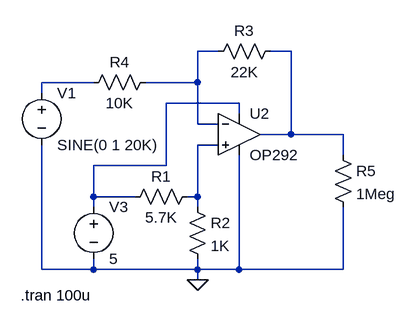
[diagram p0: schematic OpAmp-Simulation.asc]
OpAmp-Simulation.asc, the LTspice schematic file:
Version 4
SHEET 1 880 680
WIRE 64 32 32 32
WIRE 176 32 144 32
WIRE -128 80 -208 80
WIRE 32 80 32 32
WIRE 32 80 -48 80
WIRE -208 96 -208 80
WIRE 96 112 -16 112
WIRE 96 128 96 112
WIRE 32 144 32 80
WIRE 64 144 32 144
WIRE 176 160 176 32
WIRE 176 160 128 160
WIRE 256 160 176 160
WIRE 64 176 32 176
WIRE 256 192 256 160
WIRE -16 208 -16 112
WIRE -16 208 -128 208
WIRE -128 256 -128 208
WIRE -64 256 -128 256
WIRE 32 256 32 176
WIRE 32 256 16 256
WIRE -128 272 -128 256
WIRE 32 272 32 256
WIRE -208 368 -208 176
WIRE -128 368 -128 352
WIRE -128 368 -208 368
WIRE 32 368 32 352
WIRE 32 368 -128 368
WIRE 96 368 96 192
WIRE 96 368 32 368
WIRE 256 368 256 272
WIRE 256 368 96 368
WIRE 32 384 32 368
FLAG 32 384 0
SYMBOL voltage -208 80 R0
WINDOW 123 0 0 Left 0
WINDOW 39 0 0 Left 0
SYMATTR InstName V1
SYMATTR Value SINE(0 1 20K)
SYMBOL Opamps\\OP292 96 96 R0
SYMATTR InstName U2
SYMBOL res 32 240 R90
WINDOW 0 0 56 VBottom 2
WINDOW 3 32 56 VTop 2
SYMATTR InstName R1
SYMATTR Value 5.7K
SYMBOL res 16 256 R0
SYMATTR InstName R2
SYMATTR Value 1K
SYMBOL res 160 16 R90
WINDOW 0 0 56 VBottom 2
WINDOW 3 32 56 VTop 2
SYMATTR InstName R3
SYMATTR Value 22K
SYMBOL voltage -128 256 R0
WINDOW 123 0 0 Left 0
WINDOW 39 0 0 Left 0
SYMATTR InstName V3
SYMATTR Value 5
SYMBOL res -32 64 R90
WINDOW 0 0 56 VBottom 2
WINDOW 3 32 56 VTop 2
SYMATTR InstName R4
SYMATTR Value 10K
SYMBOL res 240 176 R0
SYMATTR InstName R5
SYMATTR Value 1Meg
TEXT -240 408 Left 2 !.tran 100u

The netlist it stands for:
* OpAmp-Simulation.asc
V1 N003 0 SINE(0 1 20K)
XU2 N005 N001 N004 0 N002 OP292  ; pins In+ In- V+ V- OUT
R1 N005 N004 5.7K
R2 N005 0 1K
R3 N002 N001 22K
V3 N004 0 5
R4 N001 N003 10K
R5 N002 0 1Meg
.tran 100u
.lib ADI1.lib
.backanno
.end